# Altium schematic sheet FPGA POWER.SchDoc
size A3
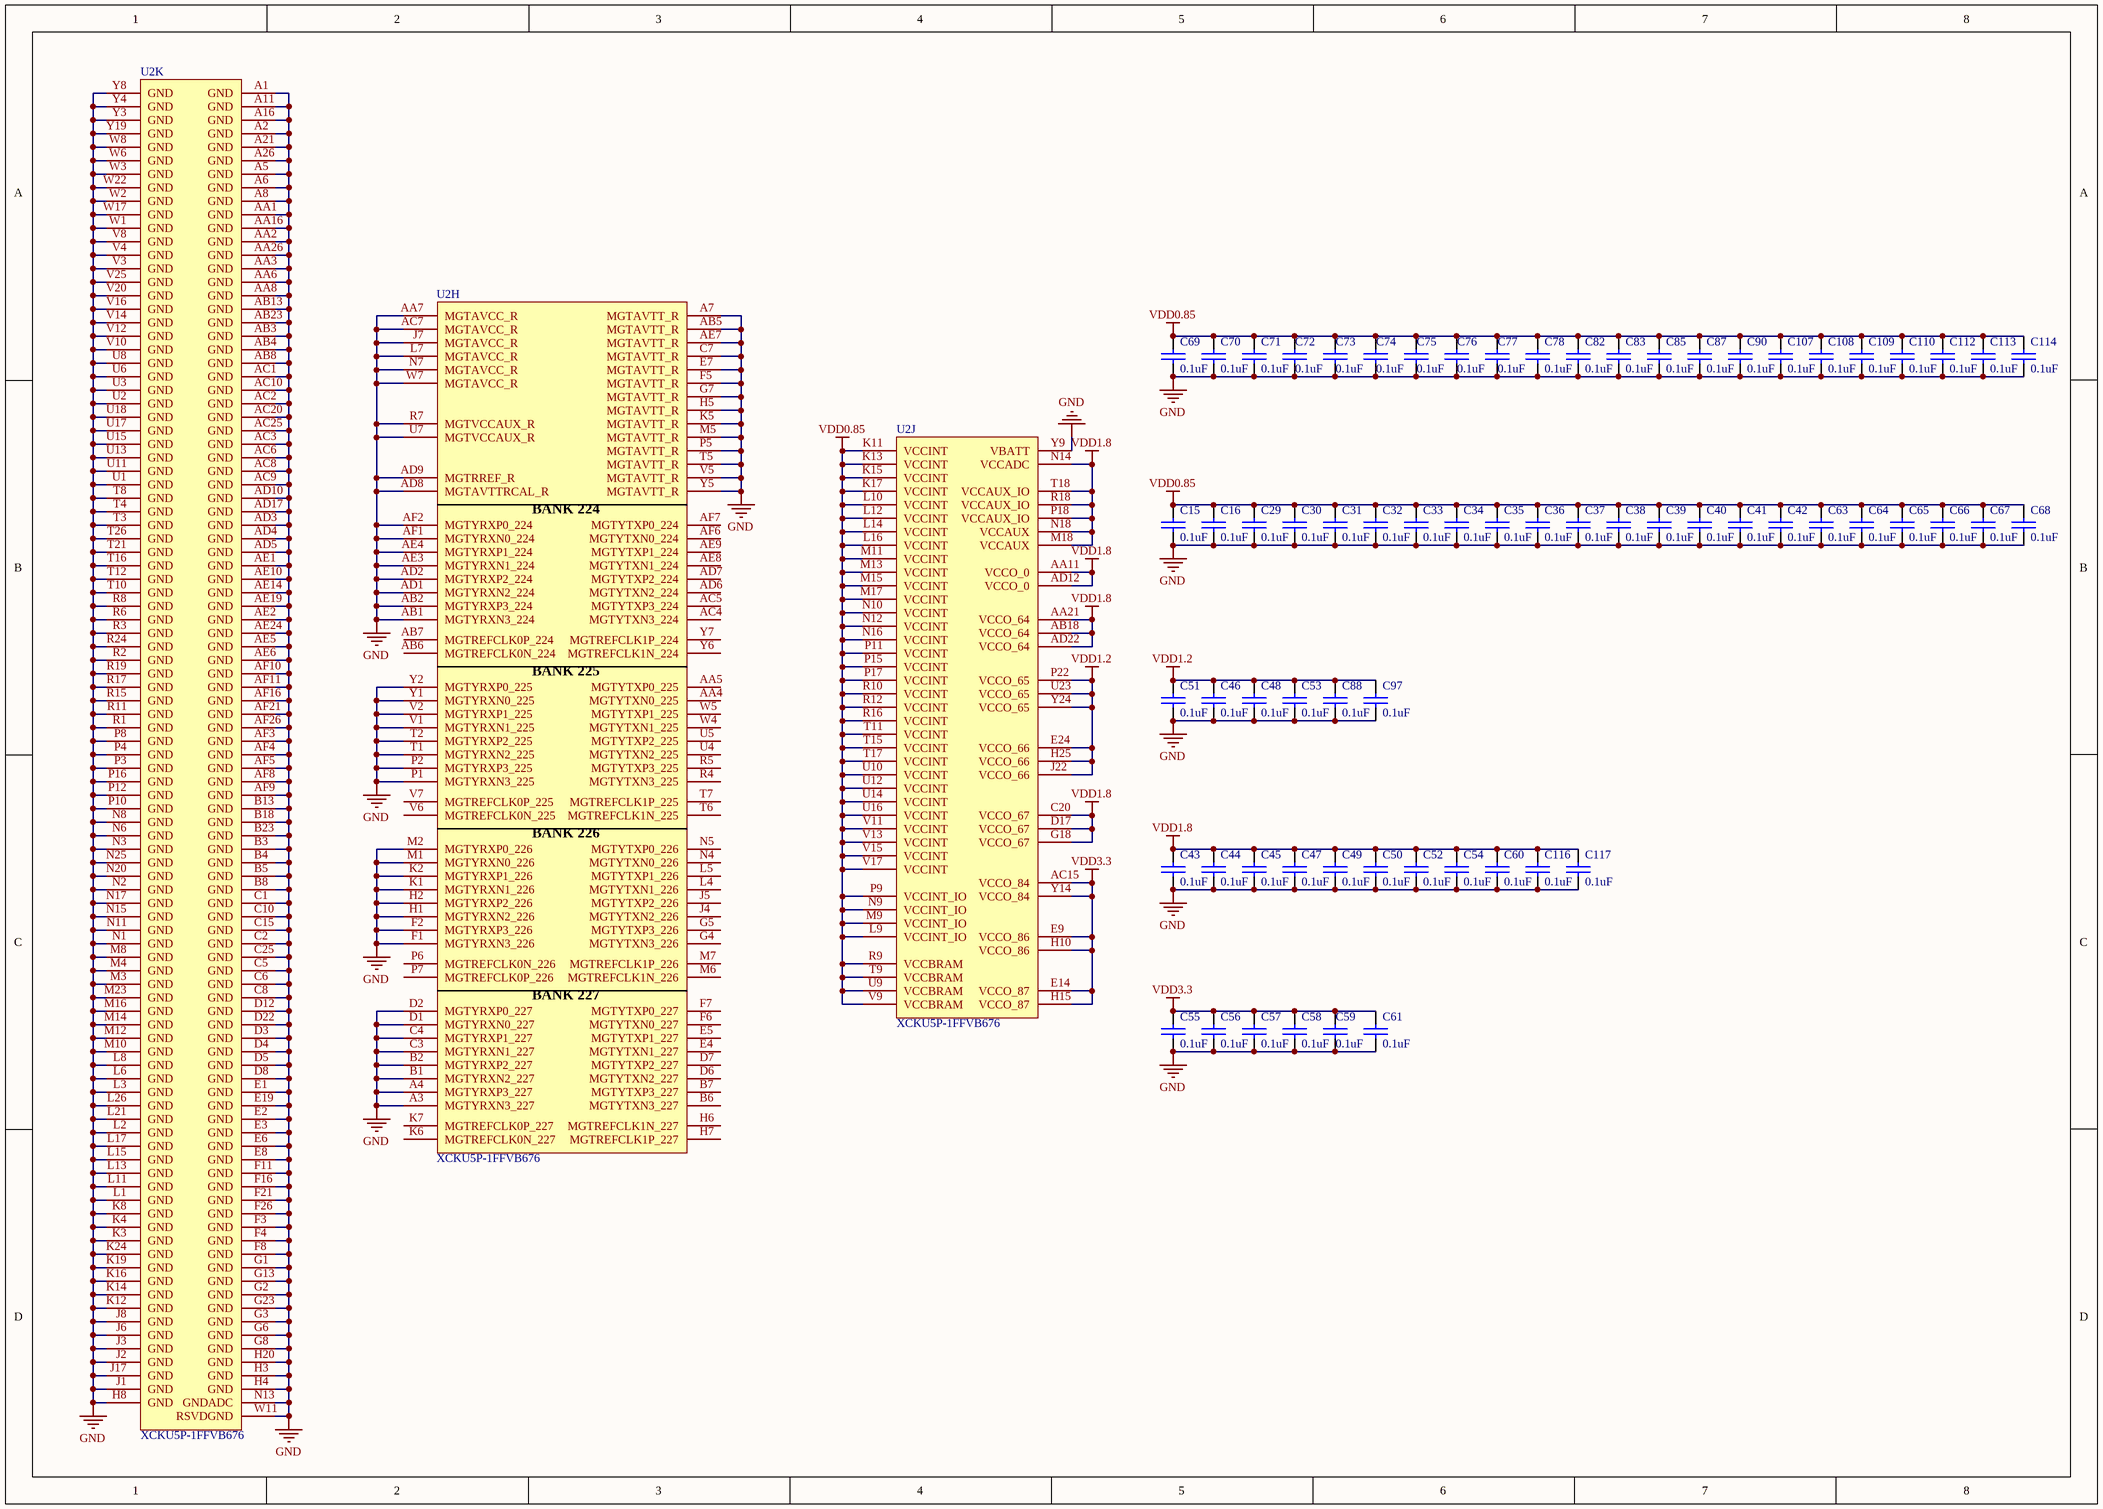
[diagram p0: FPGA POWER.SchDoc]

## Parts
C15  0.1uF  [0402_C_M]
C16  0.1uF  [0402_C_M]
C29  0.1uF  [0402_C_M]
C30  0.1uF  [0402_C_M]
C31  0.1uF  [0402_C_M]
C32  0.1uF  [0402_C_M]
C33  0.1uF  [0402_C_M]
C34  0.1uF  [0402_C_M]
C35  0.1uF  [0402_C_M]
C36  0.1uF  [0402_C_M]
C37  0.1uF  [0402_C_M]
C38  0.1uF  [0402_C_M]
C39  0.1uF  [0402_C_M]
C40  0.1uF  [0402_C_M]
C41  0.1uF  [0402_C_M]
C42  0.1uF  [0402_C_M]
C43  0.1uF  [0402_C_M]
C44  0.1uF  [0402_C_M]
C45  0.1uF  [0402_C_M]
C46  0.1uF  [0402_C_M]
C47  0.1uF  [0402_C_M]
C48  0.1uF  [0402_C_M]
C49  0.1uF  [0402_C_M]
C50  0.1uF  [0402_C_M]
C51  0.1uF  [0402_C_M]
C52  0.1uF  [0402_C_M]
C53  0.1uF  [0402_C_M]
C54  0.1uF  [0402_c_m]
C55  0.1uF  [0402_C_M]
C56  0.1uF  [0402_C_M]
C57  0.1uF  [0402_C_M]
C58  0.1uF  [0402_C_M]
C59  0.1uF  [0402_C_M]
C60  0.1uF  [0402_C_M]
C61  0.1uF  [0402_C_M]
C63  0.1uF  [0402_C_M]
C64  0.1uF  [0402_C_M]
C65  0.1uF  [0402_C_M]
C66  0.1uF  [0402_C_M]
C67  0.1uF  [0402_C_M]
C68  0.1uF  [0402_C_M]
C69  0.1uF  [0402_C_M]
C70  0.1uF  [0402_C_M]
C71  0.1uF  [0402_C_M]
C72  0.1uF  [0402_C_M]
C73  0.1uF  [0402_C_M]
C74  0.1uF  [0402_C_M]
C75  0.1uF  [0402_C_M]
C76  0.1uF  [0402_C_M]
C77  0.1uF  [0402_C_M]
C78  0.1uF  [0402_C_M]
C82  0.1uF  [0402_C_M]
C83  0.1uF  [0402_C_M]
C85  0.1uF  [0402_C_M]
C87  0.1uF  [0402_C_M]
C88  0.1uF  [0402_C_M]
C90  0.1uF  [0402_C_M]
C97  0.1uF  [0402_C_M]
C107  0.1uF  [0402_C_M]
C108  0.1uF  [0402_C_M]
C109  0.1uF  [0402_C_M]
C110  0.1uF  [0402_C_M]
C112  0.1uF  [0402_C_M]
C113  0.1uF  [0402_C_M]
C114  0.1uF  [0402_C_M]
C116  0.1uF  [0402_C_M]
C117  0.1uF  [0402_C_M]
U2  XCKU5P-1FFVB676  (parts H,J,K of 11)

## Nets
GND: C15.2 C16.2 C29.2 C30.2 C31.2 C32.2 C33.2 C34.2 C35.2 C36.2 C37.2 C38.2 C39.2 C40.2 C41.2 C42.2 C43.2 C44.2 C45.2 C46.2 C47.2 C48.2 C49.2 C50.2 C51.2 C52.2 C53.2 C54.2 C55.2 C56.2 C57.2 C58.2 C59.2 C60.2 C61.2 C63.2 C64.2 C65.2 C66.2 C67.2 C68.2 C69.2 C70.2 C71.2 C72.2 C73.2 C74.2 C75.2 C76.2 C77.2 C78.2 C82.2 C83.2 C85.2 C87.2 C88.2 C90.2 C97.2 C107.2 C108.2 C109.2 C110.2 C112.2 C113.2 C114.2 C116.2 C117.2 U2.A1(GND) U2.A2(GND) U2.A3(MGTYRXN3_227) U2.A4(MGTYRXP3_227) U2.A5(GND) U2.A6(GND) U2.A7(MGTAVTT_R) U2.A8(GND) U2.A11(GND) U2.A16(GND) U2.A21(GND) U2.A26(GND) U2.AA1(GND) U2.AA2(GND) U2.AA3(GND) U2.AA6(GND) U2.AA7(MGTAVCC_R) U2.AA8(GND) U2.AA16(GND) U2.AA26(GND) U2.AB1(MGTYRXN3_224) U2.AB2(MGTYRXP3_224) U2.AB3(GND) U2.AB4(GND) U2.AB5(MGTAVTT_R) U2.AB8(GND) U2.AB13(GND) U2.AB23(GND) U2.AC1(GND) U2.AC2(GND) U2.AC3(GND) U2.AC6(GND) U2.AC7(MGTAVCC_R) U2.AC8(GND) U2.AC9(GND) U2.AC10(GND) U2.AC20(GND) U2.AC25(GND) U2.AD1(MGTYRXN2_224) U2.AD2(MGTYRXP2_224) U2.AD3(GND) U2.AD4(GND) U2.AD5(GND) U2.AD8(MGTAVTTRCAL_R) U2.AD9(MGTRREF_R) U2.AD10(GND) U2.AD17(GND) U2.AE1(GND) U2.AE2(GND) U2.AE3(MGTYRXN1_224) U2.AE4(MGTYRXP1_224) U2.AE5(GND) U2.AE6(GND) U2.AE7(MGTAVTT_R) U2.AE10(GND) U2.AE14(GND) U2.AE19(GND) U2.AE24(GND) U2.AF1(MGTYRXN0_224) U2.AF2(MGTYRXP0_224) U2.AF3(GND) U2.AF4(GND) U2.AF5(GND) U2.AF8(GND) U2.AF9(GND) U2.AF10(GND) U2.AF11(GND) U2.AF16(GND) U2.AF21(GND) U2.AF26(GND) U2.B1(MGTYRXN2_227) U2.B2(MGTYRXP2_227) U2.B3(GND) U2.B4(GND) U2.B5(GND) U2.B8(GND) U2.B13(GND) U2.B18(GND) U2.B23(GND) U2.C1(GND) U2.C2(GND) U2.C3(MGTYRXN1_227) U2.C4(MGTYRXP1_227) U2.C5(GND) U2.C6(GND) U2.C7(MGTAVTT_R) U2.C8(GND) U2.C10(GND) U2.C15(GND) U2.C25(GND) U2.D1(MGTYRXN0_227) U2.D2(MGTYRXP0_227) U2.D3(GND) U2.D4(GND) U2.D5(GND) U2.D8(GND) U2.D12(GND) U2.D22(GND) U2.E1(GND) U2.E2(GND) U2.E3(GND) U2.E6(GND) U2.E7(MGTAVTT_R) U2.E8(GND) U2.E19(GND) U2.F1(MGTYRXN3_226) U2.F2(MGTYRXP3_226) U2.F3(GND) U2.F4(GND) U2.F5(MGTAVTT_R) U2.F8(GND) U2.F11(GND) U2.F16(GND) U2.F21(GND) U2.F26(GND) U2.G1(GND) U2.G2(GND) U2.G3(GND) U2.G6(GND) U2.G7(MGTAVTT_R) U2.G8(GND) U2.G13(GND) U2.G23(GND) U2.H1(MGTYRXN2_226) U2.H2(MGTYRXP2_226) U2.H3(GND) U2.H4(GND) U2.H5(MGTAVTT_R) U2.H8(GND) U2.H20(GND) U2.J1(GND) U2.J2(GND) U2.J3(GND) U2.J6(GND) U2.J7(MGTAVCC_R) U2.J8(GND) U2.J17(GND) U2.K1(MGTYRXN1_226) U2.K2(MGTYRXP1_226) U2.K3(GND) U2.K4(GND) U2.K5(MGTAVTT_R) U2.K8(GND) U2.K12(GND) U2.K14(GND) U2.K16(GND) U2.K19(GND) U2.K24(GND) U2.L1(GND) U2.L2(GND) U2.L3(GND) U2.L6(GND) U2.L7(MGTAVCC_R) U2.L8(GND) U2.L11(GND) U2.L13(GND) U2.L15(GND) U2.L17(GND) U2.L21(GND) U2.L26(GND) U2.M1(MGTYRXN0_226) U2.M2(MGTYRXP0_226) U2.M3(GND) U2.M4(GND) U2.M5(MGTAVTT_R) U2.M8(GND) U2.M10(GND) U2.M12(GND) U2.M14(GND) U2.M16(GND) U2.M23(GND) U2.N1(GND) U2.N2(GND) U2.N3(GND) U2.N6(GND) U2.N7(MGTAVCC_R) U2.N8(GND) U2.N11(GND) U2.N13(GNDADC) U2.N15(GND) U2.N17(GND) U2.N20(GND) U2.N25(GND) U2.P1(MGTYRXN3_225) U2.P2(MGTYRXP3_225) U2.P3(GND) U2.P4(GND) U2.P5(MGTAVTT_R) U2.P8(GND) U2.P10(GND) U2.P12(GND) U2.P16(GND) U2.R1(GND) U2.R2(GND) U2.R3(GND) U2.R6(GND) U2.R7(MGTVCCAUX_R) U2.R8(GND) U2.R11(GND) U2.R15(GND) U2.R17(GND) U2.R19(GND) U2.R24(GND) U2.T1(MGTYRXN2_225) U2.T2(MGTYRXP2_225) U2.T3(GND) U2.T4(GND) U2.T5(MGTAVTT_R) U2.T8(GND) U2.T10(GND) U2.T12(GND) U2.T16(GND) U2.T21(GND) U2.T26(GND) U2.U1(GND) U2.U2(GND) U2.U3(GND) U2.U6(GND) U2.U7(MGTVCCAUX_R) U2.U8(GND) U2.U11(GND) U2.U13(GND) U2.U15(GND) U2.U17(GND) U2.U18(GND) U2.V1(MGTYRXN1_225) U2.V2(MGTYRXP1_225) U2.V3(GND) U2.V4(GND) U2.V5(MGTAVTT_R) U2.V8(GND) U2.V10(GND) U2.V12(GND) U2.V14(GND) U2.V16(GND) U2.V20(GND) U2.V25(GND) U2.W1(GND) U2.W2(GND) U2.W3(GND) U2.W6(GND) U2.W7(MGTAVCC_R) U2.W8(GND) U2.W11(RSVDGND) U2.W17(GND) U2.W22(GND) U2.Y1(MGTYRXN0_225) U2.Y2(MGTYRXP0_225) U2.Y3(GND) U2.Y4(GND) U2.Y5(MGTAVTT_R) U2.Y8(GND) U2.Y9(VBATT) U2.Y19(GND)
VDD0.85: C15.1 C16.1 C29.1 C30.1 C31.1 C32.1 C33.1 C34.1 C35.1 C36.1 C37.1 C38.1 C39.1 C40.1 C41.1 C42.1 C63.1 C64.1 C65.1 C66.1 C67.1 C68.1 C69.1 C70.1 C71.1 C72.1 C73.1 C74.1 C75.1 C76.1 C77.1 C78.1 C82.1 C83.1 C85.1 C87.1 C90.1 C107.1 C108.1 C109.1 C110.1 C112.1 C113.1 C114.1 U2.K11(VCCINT) U2.K13(VCCINT) U2.K15(VCCINT) U2.K17(VCCINT) U2.L9(VCCINT_IO) U2.L10(VCCINT) U2.L12(VCCINT) U2.L14(VCCINT) U2.L16(VCCINT) U2.M9(VCCINT_IO) U2.M11(VCCINT) U2.M13(VCCINT) U2.M15(VCCINT) U2.M17(VCCINT) U2.N9(VCCINT_IO) U2.N10(VCCINT) U2.N12(VCCINT) U2.N16(VCCINT) U2.P9(VCCINT_IO) U2.P11(VCCINT) U2.P15(VCCINT) U2.P17(VCCINT) U2.R9(VCCBRAM) U2.R10(VCCINT) U2.R12(VCCINT) U2.R16(VCCINT) U2.T9(VCCBRAM) U2.T11(VCCINT) U2.T15(VCCINT) U2.T17(VCCINT) U2.U9(VCCBRAM) U2.U10(VCCINT) U2.U12(VCCINT) U2.U14(VCCINT) U2.U16(VCCINT) U2.V9(VCCBRAM) U2.V11(VCCINT) U2.V13(VCCINT) U2.V15(VCCINT) U2.V17(VCCINT)
VDD1.2: C46.1 C48.1 C51.1 C53.1 C88.1 C97.1 U2.E24(VCCO_66) U2.H25(VCCO_66) U2.J22(VCCO_66) U2.P22(VCCO_65) U2.U23(VCCO_65) U2.Y24(VCCO_65)
VDD1.8: C43.1 C44.1 C45.1 C47.1 C49.1 C50.1 C52.1 C54.1 C60.1 C116.1 C117.1 U2.AA11(VCCO_0) U2.AA21(VCCO_64) U2.AB18(VCCO_64) U2.AD12(VCCO_0) U2.AD22(VCCO_64) U2.C20(VCCO_67) U2.D17(VCCO_67) U2.G18(VCCO_67) U2.M18(VCCAUX) U2.N14(VCCADC) U2.N18(VCCAUX) U2.P18(VCCAUX_IO) U2.R18(VCCAUX_IO) U2.T18(VCCAUX_IO)
VDD3.3: C55.1 C56.1 C57.1 C58.1 C59.1 C61.1 U2.AC15(VCCO_84) U2.E9(VCCO_86) U2.E14(VCCO_87) U2.H10(VCCO_86) U2.H15(VCCO_87) U2.Y14(VCCO_84)

Not connected (* = marked no-connect by the designer): U2 AA4(MGTYTXN0_225) AA5(MGTYTXP0_225) AB6(MGTREFCLK0N_224) AB7(MGTREFCLK0P_224) AC4(MGTYTXN3_224) AC5(MGTYTXP3_224) AD6(MGTYTXN2_224) AD7(MGTYTXP2_224) AE8(MGTYTXN1_224) AE9(MGTYTXP1_224) AF6(MGTYTXN0_224) AF7(MGTYTXP0_224) B6(MGTYTXN3_227) B7(MGTYTXP3_227) D6(MGTYTXN2_227) D7(MGTYTXP2_227) E4(MGTYTXN1_227) E5(MGTYTXP1_227) F6(MGTYTXN0_227) F7(MGTYTXP0_227) G4(MGTYTXN3_226) G5(MGTYTXP3_226) H6(MGTREFCLK1N_227) H7(MGTREFCLK1P_227) J4(MGTYTXN2_226) J5(MGTYTXP2_226) K6(MGTREFCLK0N_227) K7(MGTREFCLK0P_227) L4(MGTYTXN1_226) L5(MGTYTXP1_226) M6(MGTREFCLK1N_226) M7(MGTREFCLK1P_226) N4(MGTYTXN0_226) N5(MGTYTXP0_226) P6(MGTREFCLK0N_226) P7(MGTREFCLK0P_226) R4(MGTYTXN3_225) R5(MGTYTXP3_225) T6(MGTREFCLK1N_225) T7(MGTREFCLK1P_225) U4(MGTYTXN2_225) U5(MGTYTXP2_225) V6(MGTREFCLK0N_225) V7(MGTREFCLK0P_225) W4(MGTYTXN1_225) W5(MGTYTXP1_225) Y6(MGTREFCLK1N_224) Y7(MGTREFCLK1P_224)

## Notes on the sheet
- (in symbol XCKU5P-FFVB676, part H) BANK 224; BANK 225; BANK 226; BANK 227

## Library data of the parts
C15 C16 C29-C61 C63-C78 C82 C83 C85 C87 C88 C90 C97 C107-C110 C112-C114 C116 C117 = CAP
U2 = XCKU5P-FFVB676